# Altium schematic sheet -PWF2403D-6W.SchDoc
size A4
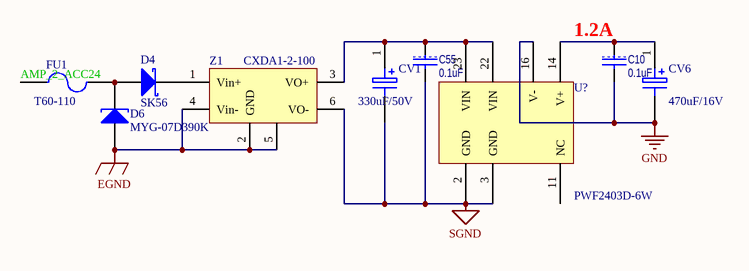
[diagram p0: -PWF2403D-6W.SchDoc]

## Parts
C10  0.1uF  [1608[0603]]
C55  0.1uF  [1608[0603]]
CV1  330uF/50V  [CAPPR5-10x20/H1.1]
CV6  470uF/16V  [CAP8484X100M]
D4  SK56  [DIODE_SMC]
D6  MYG-07D390K  [FUS-0.2]
FU1  T60-110  [FUS-0.2]
U?  PWF2403D-6W  [DIP-7(24)W]
Z1  CXDA1-2-100  [CXDA1-2-100]

## Nets
EGND: D6.1(A) Z1.2(GND) Z1.4(Vin-) Z1.5(GND)
GND: C10.2 CV6.2 U?.16(V-)
SGND: C55.2 CV1.2 U?.2(GND) U?.3(GND) Z1.6(VO-)
AMP_2_ACC24: FU1.1
NetC10_1: C10.1 CV6.1 U?.14(V+)
NetC55_1: C55.1 CV1.1 U?.22(VIN) U?.23(VIN) Z1.3(VO+)
NetD4_1: D4.1(A) D6.2(K) FU1.2
NetD4_2: D4.2(K) Z1.1(Vin+)

Not connected (* = marked no-connect by the designer): U? 11(NC)

## Notes on the sheet
- (near C10) 1.2A

## Library data of the parts
C10 = CAP: 电容
C55 = CAP: Capacitor; Manufacturer: TDK; Type: 无铅电容; Model: C0603X7R1H104K; Value: 0.1uF
CV1 = ELECTRO1: 插针铝电解电容; Value: 50ZL270MEFC10x20; 公司: 红宝石; Model: SL050K0220A5S-1019; Parameter: 220uF/50V
CV6 = ELECTRO1: 铝电解电容; Value: 220uF; Votage: 16V; Compy: Yageo 国巨; Environment: 105 'C 2000Hour
D4 = D Schottky: 肖特基二极管; Published: 8-Jun-2000; LatestRevisionDate: 17-Jul-2002; LatestRevisionNote: Re-released for DXP Platform.; PackageReference: SMB; Publisher: Altium Limited; PackageDescription: DO-214-AA/SMB; 2 C-Bend Leads; Body 5.3 x 3.6 mm, inc. leads (LxW); Code_JEDEC: DO-214-AA
D6 = D Tunnel2: Tunnel Diode - Dependent Source Model; Published: 15-Apr-2002; LatestRevisionDate: 17-Jul-2002; LatestRevisionNote: Re-released for DXP Platform.; PackageReference: DIODE-0.4; Publisher: Altium Limited; PackageDescription: Diode, Thru-Hole; 2 Leads; 0.4 in Pin Spacing
FU1 = Fuse 2: FUSE; 公司: 美国泰科; 参数: 63V 2A; Published: 8-Jun-2000; LatestRevisionDate: 17-Jul-2002; LatestRevisionNote: Re-released for DXP Platform.; PackageReference: PIN-W2/E2.8; Publisher: Altium Limited; PackageDescription: Thru-Hole; 2 Leads
U? = PWF_D-6W: PWF_D-6W 4:1 3000V 78%
Z1 = CXDB: Filter; 公司: 中北创新